# EAGLE design receiver (EAGLE 7.4.0)
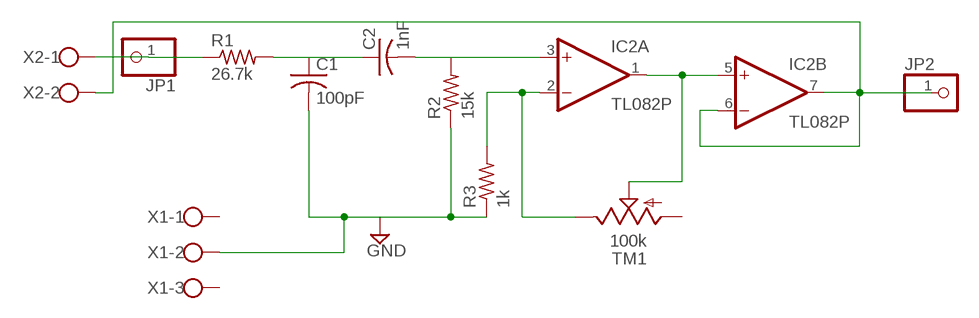
[diagram p0: schematic, sheet 1]

## Parts
C1  100pF  C-US050-045X075  [C050-045X075]
C2  1nF  C-US050-045X075  [C050-045X075]
IC2  TL082P  [DIL08]
JP1  PINHD-1X1CB  [1X01-CLEANBIG]
JP2  PINHD-1X1CB  [1X01-CLEANBIG]
R1  26.7k  R-US_0309/10  [0309/10]
R2  15k  R-US_0309/10  [0309/10]
R3  1k  R-US_0309/10  [0309/10]
TM1  100k  TRIM  [6MM]
X1  W237-103  [W237-103]
X2  W237-102  [W237-102]

## Nets
GND: C1.2 R2.1 R3.1 X1.2
N$1: JP1.1 R1.1 X2.1
N$2: C1.1 C2.1 R1.2
N$3: C2.2 IC2.3(A:+IN) R2.2
N$5: IC2.2(A:-IN) R3.2 TM1.E
N$6: IC2.1(A:OUT) IC2.5(B:+IN) TM1.S
N$7: IC2.6(B:-IN) IC2.7(B:OUT) JP2.1 X2.2
Unconnected: TM1.A X1.1 X1.3

## Power pins joined to a net without a drawn wire
V+: IC2.8(P:V+)
V-: IC2.4(P:V-)

## Library data of the parts
C1 C2 = adafruit:C-US: CAPACITOR, American symbol
IC2 = linear:TL082: OP AMP Data sheet <http://www.ti.com/lit/ds/symlink/tl084a . pdf>; DATA_SHEET: <a href="http://www.ti.com/lit/ds/symlink/tl084a.pdf"> Data sheet </a>
JP1 JP2 = adafruit:PINHD-1X1: Pin header 1x1 for 0.1" spacing With round pins
R1-R3 = adafruit:R-US_: RESISTOR, American symbol
TM1 = adafruit:TRIM
X1 = con-wago-500:W237-103: WAGO SCREW CLAMP; MPN: 237-103; OC_FARNELL: unknown; OC_NEWARK: 18M7116
X2 = con-wago-500:W237-102: WAGO SCREW CLAMP; MPN: 237-102; OC_FARNELL: unknown; OC_NEWARK: 70K9898

## Board
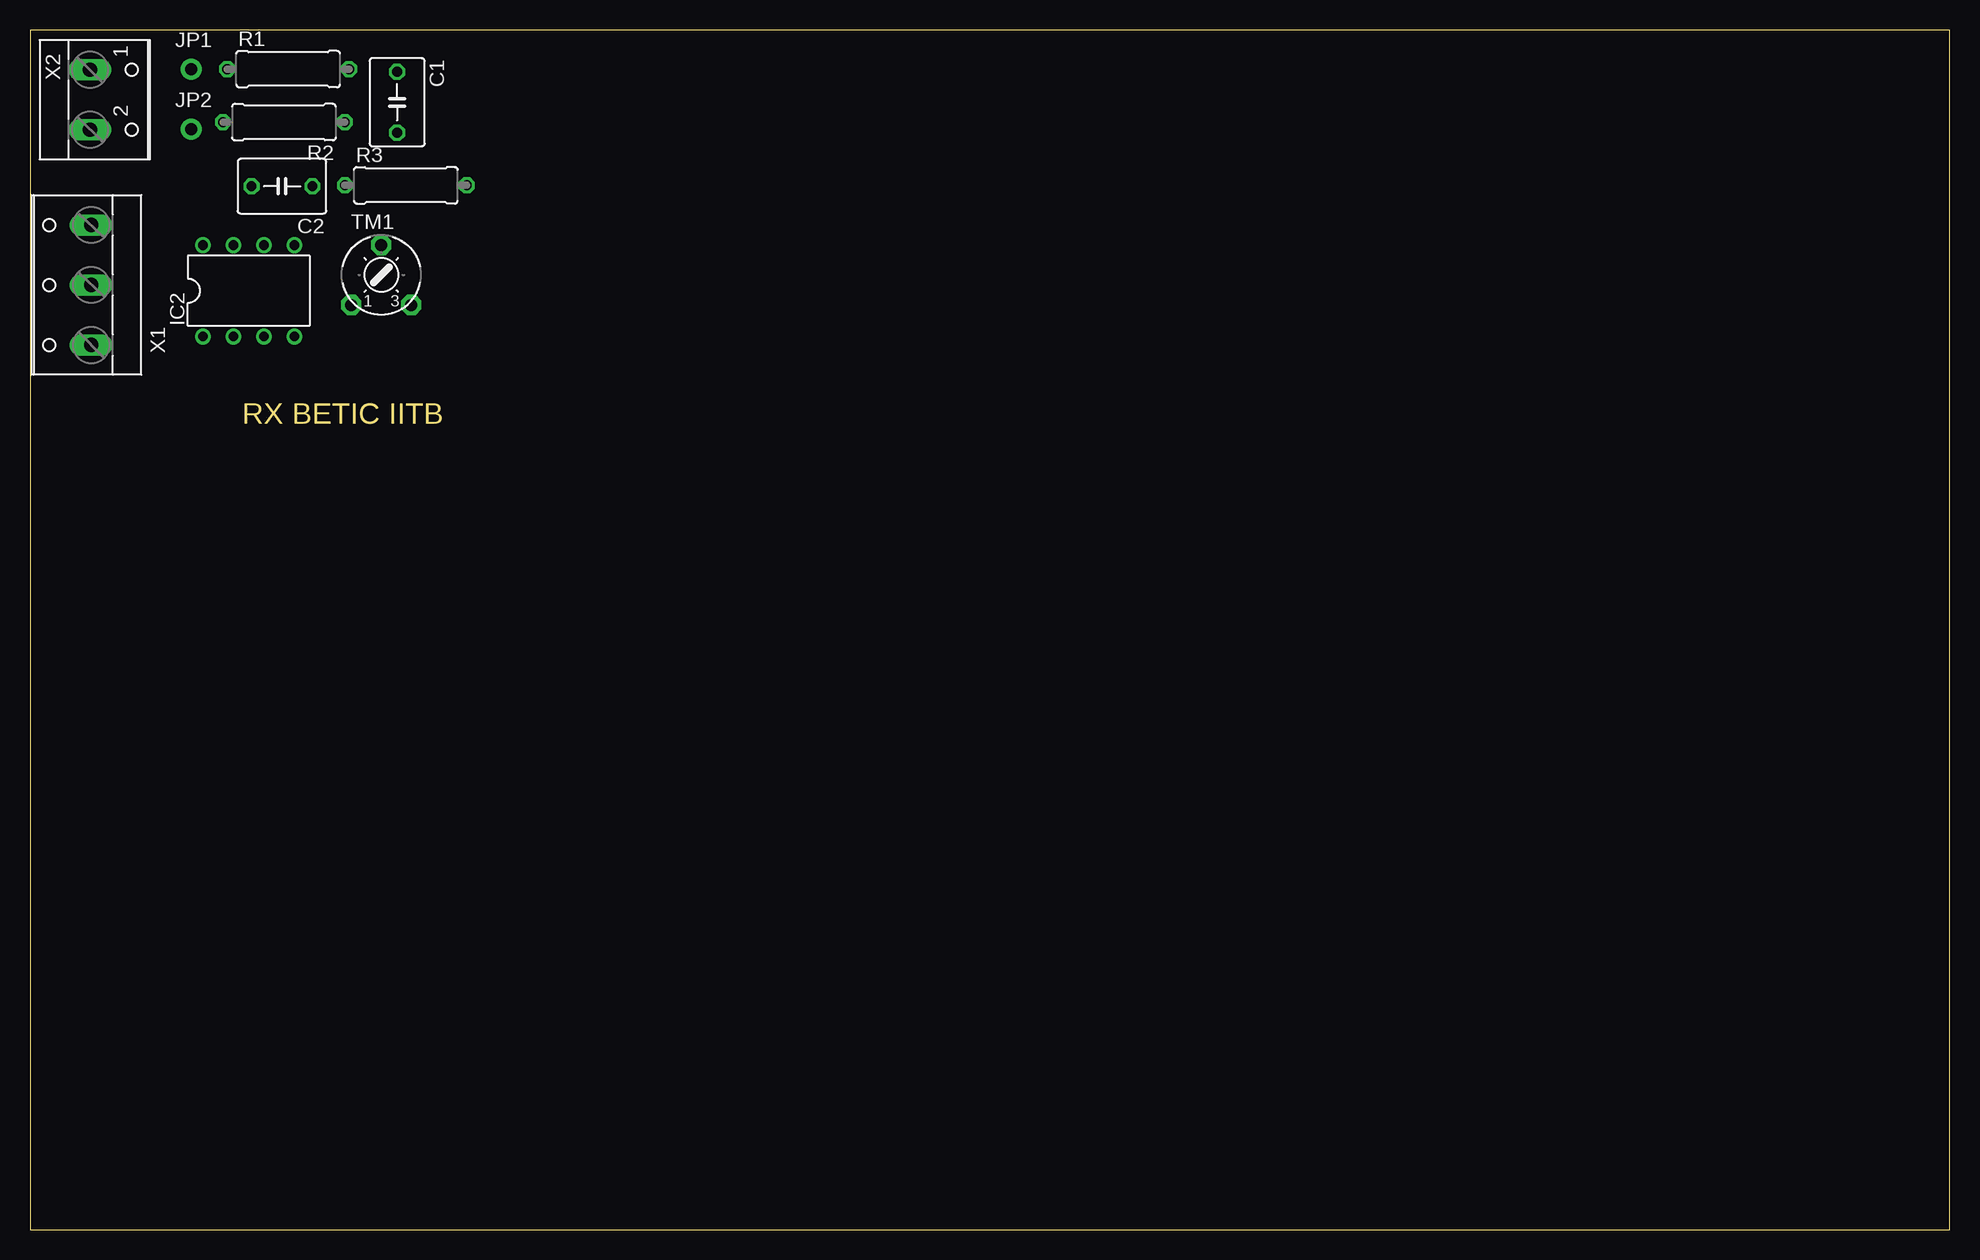
[diagram p1: board, top side]
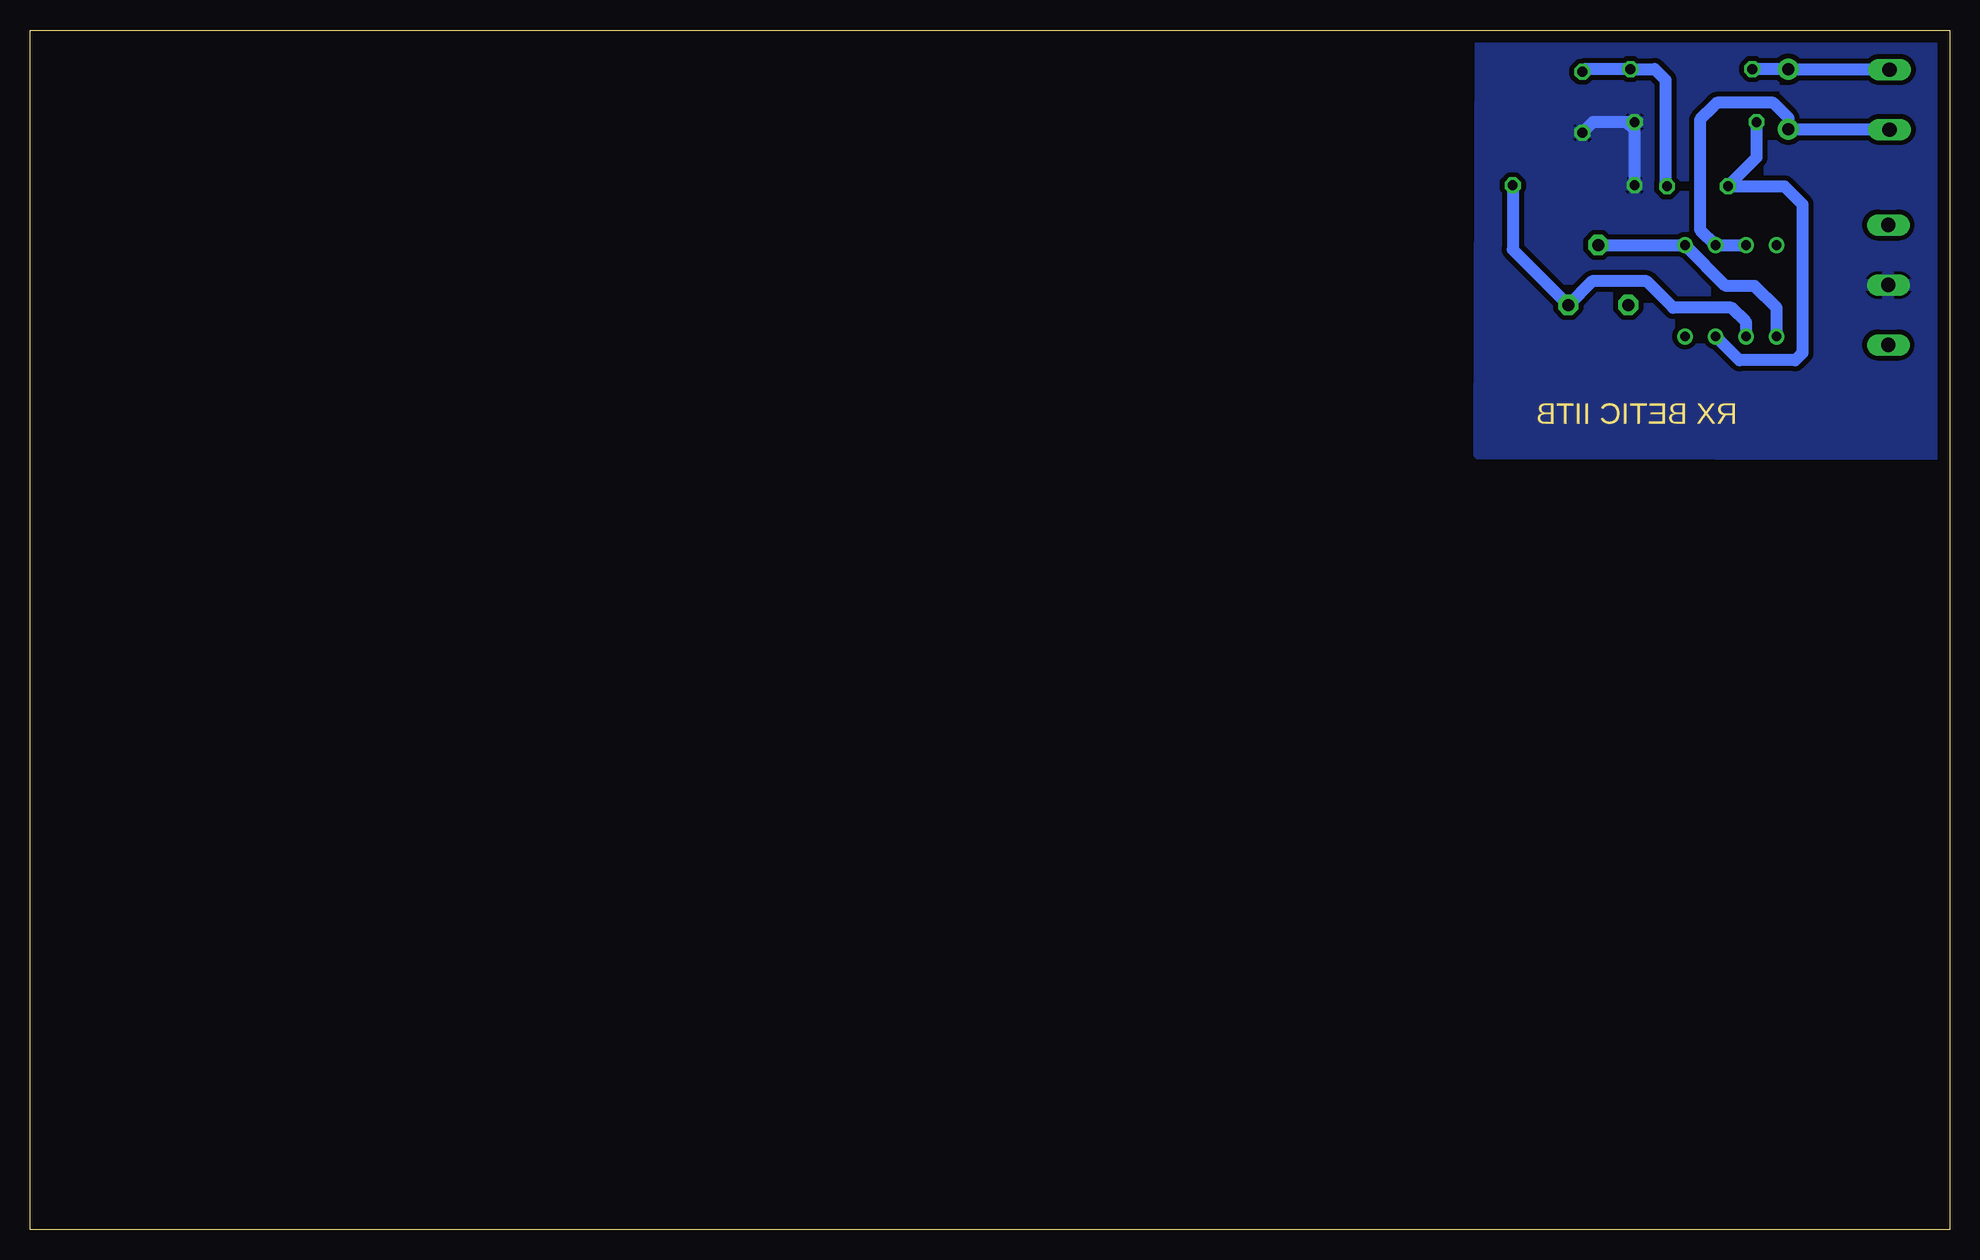
[diagram p2: board, bottom side, seen from below]

Size 160 x 100 mm. Coordinates in mm from the lower left corner, seen from the top.
Outline: 0,0 160,0 160,100 0,100 0,0
Copper layers (1*16): Top 0.035mm / dielectric 1.5mm / Bottom 0.035mm
Design rules "default *": minimum track width 10mil, minimum drill 24mil, track to track 16mil, track to pad 16mil, pad to pad 8mil, via to via 8mil, smd to smd 8mil, copper to edge 40mil, drill to drill 8mil, minimum pad ring 10mil, minimum via ring 8mil, stop-mask expansion 4mil, vias tented up to drill 0mil, thermal gap 10mil

### Footprints (pad centres in the part's own frame; a part is rotated, then mirrored left to right if it is on the bottom)
C050-045X075 = drill 0.813 octagon: 1 -2.54,0; 2 2.54,0
DIL08 = drill 0.813 pad 1.27: 1 -3.81,-3.81; 2 -1.27,-3.81; 3 1.27,-3.81; 4 3.81,-3.81; 5 3.81,3.81; 6 1.27,3.81; 7 -1.27,3.81; 8 -3.81,3.81
1X01-CLEANBIG = drill 1.016 pad 1.778: 1 0,0
0309/10 = drill 0.813 octagon: 1 -5.08,0; 2 5.08,0
6MM = drill 1 pad 1.676 octagon: A -2.5,-2.5; E 2.5,-2.5; S 0,2.5
W237-103 = drill 1.194 long: 1 -5,-1.29; 2 0,-1.29; 3 5,-1.29
W237-102 = drill 1.194 long: 1 -2.5,-1.27; 2 2.5,-1.27

### Placement (x,y rotation side)
C1  30.6,93.98 270 top
C2  21.01,86.97 180 top
IC2  18.23,78.26 0 top
JP1  13.44,96.73 0 top
JP2  13.44,91.72 0 top
R1  21.52,96.74 0 top
R2  21.16,92.32 180 top
R3  31.33,87.06 0 top
TM1  29.28,79.58 0 top
X1  3.81,78.74 90 top
X2  6.27,94.19 270 top

### Tracks (layer width: path | path; a pad name or v marks a point on that pad's centre or on a via)
GND
  Bottom 1.016: R2.1 26.93,92.32 | 26.93,92.32 29.71,92.32 C1.2 | R3.1 26.25,91.64 26.93,92.32
  pour Bottom: 0,100 -0.07,64.6 39.2,64.68 39.05,99.98 0.03,99.98 0.03,99.99
N$1
  Bottom 1.016: X2.1 13.41,96.69 JP1.1 16.43,96.72 R1.1
N$2
  Bottom 1.016: C1.1 30.38,96.74 R1.2 24.57,96.74 23.68,95.84 23.68,87.11 C2.1
N$3
  Bottom 1.016: R2.2 16.08,89.36 C2.2 13.75,86.97 12.25,85.47 12.25,73.07 12.86,72.46 17.51,72.46 IC2.3
N$5
  Bottom 1.016: R3.2 36.41,81.71 TM1.E 29.8,79.06 25.24,79.06 23.02,76.84 18.17,76.84 16.96,75.63 IC2.2
N$6
  Bottom 1.016: IC2.1 14.42,76.82 16.26,78.66 18.63,78.66 IC2.5 22.05,82.08 TM1.S
N$7
  Bottom 1.016: X2.2 13.4,91.69 | 13.4,91.69 JP2.1 | 13.4,91.69 13.4,92.64 14.7,93.94 19.4,93.94 19.66,93.68 19.66,93.65 20.79,92.51 20.79,83.36 IC2.6 IC2.7

### Text on the board
Dimension: RX BETIC IITB